# Altium schematic sheet STM32F407VET6.SchDoc
size 566 x 304 mm
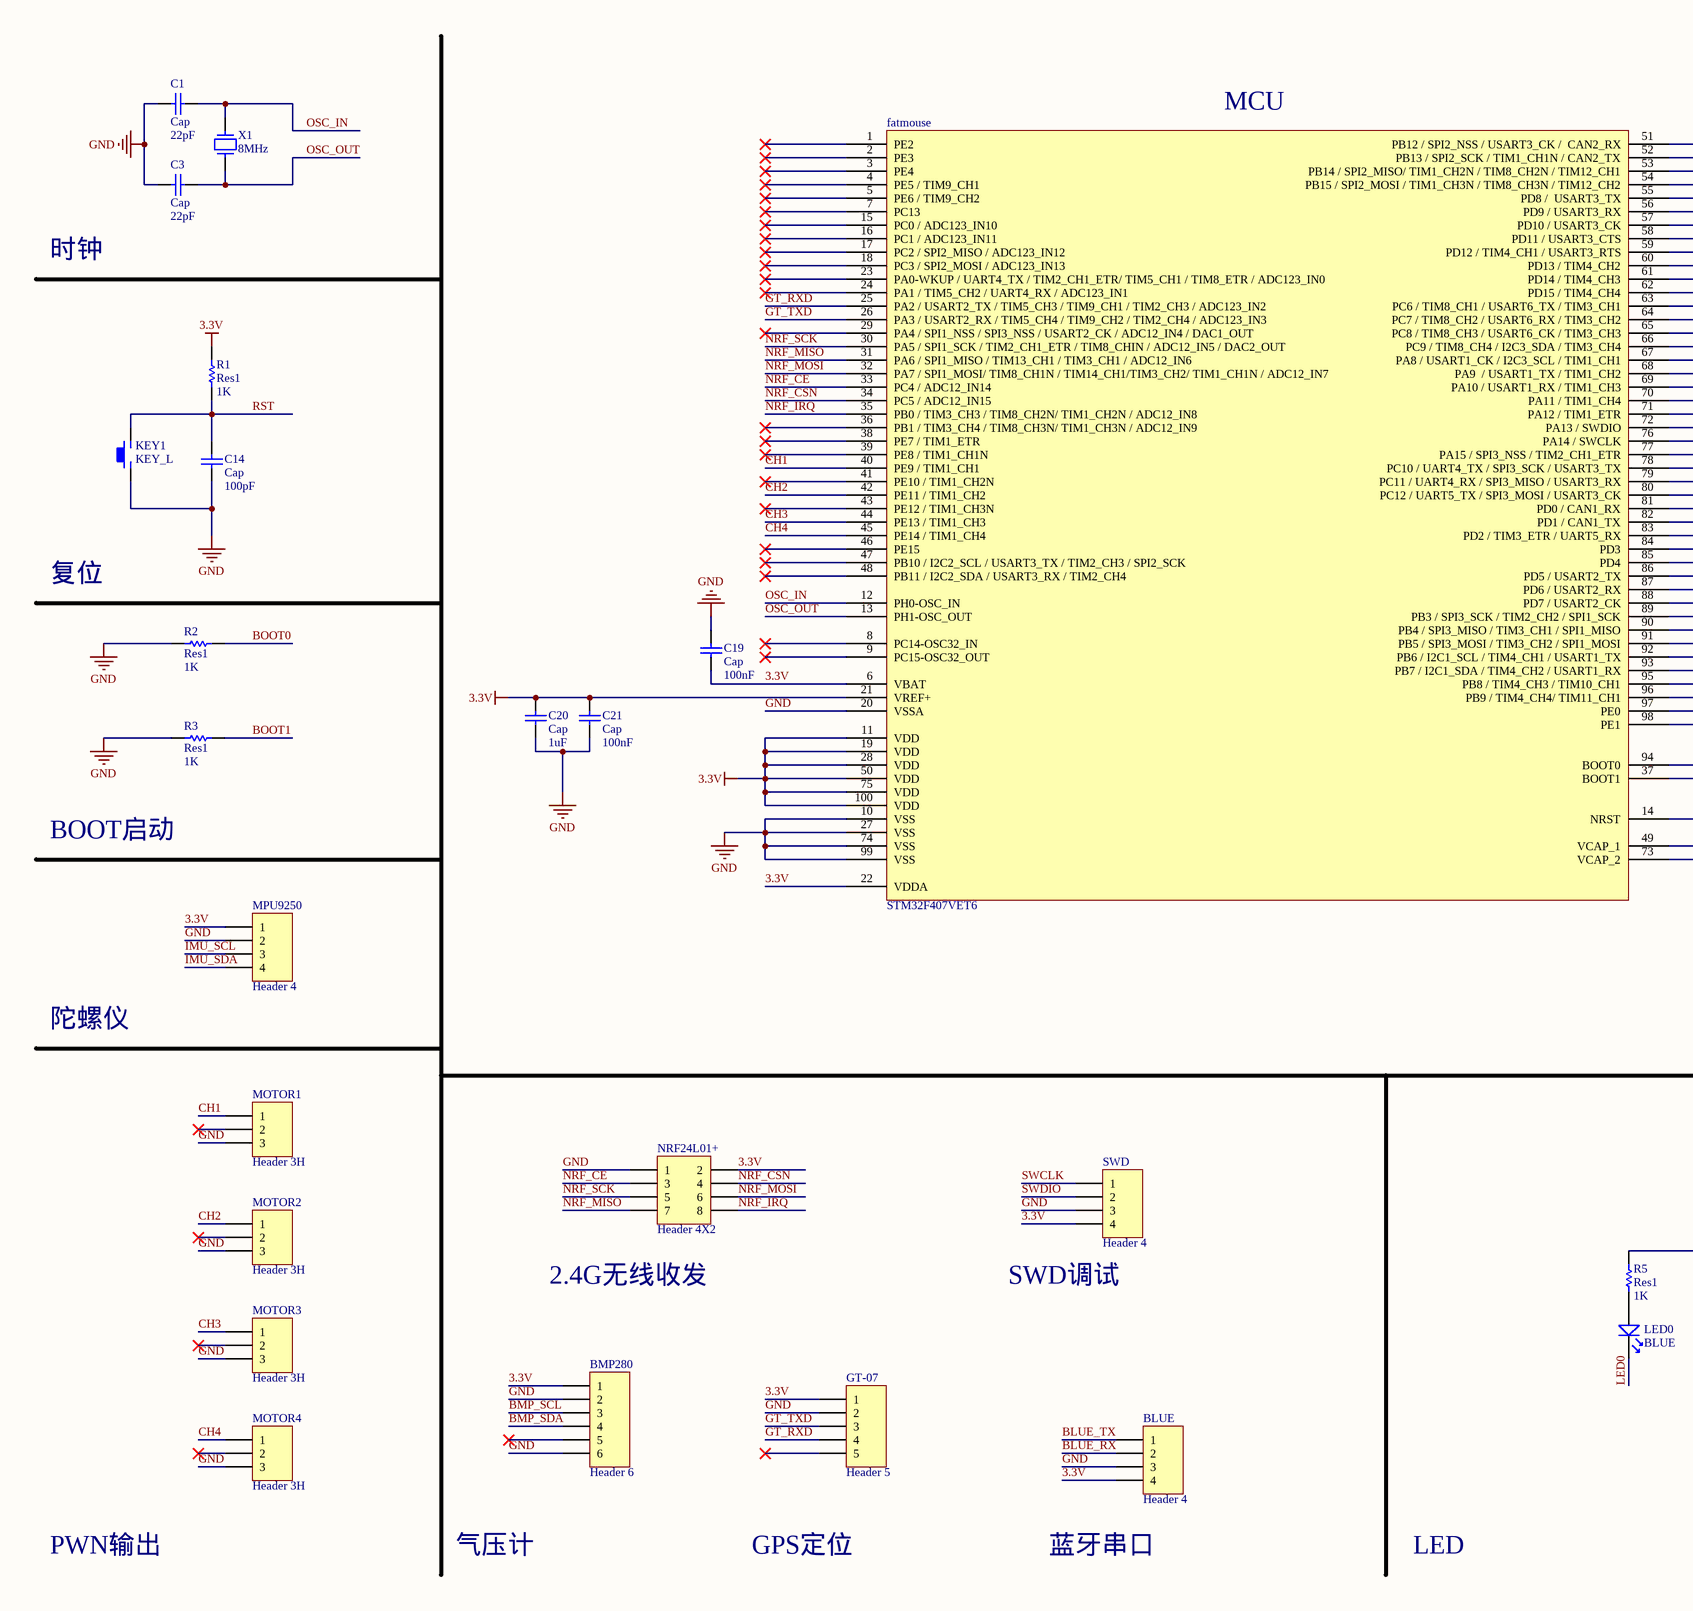
[diagram p0: STM32F407VET6.SchDoc, left]
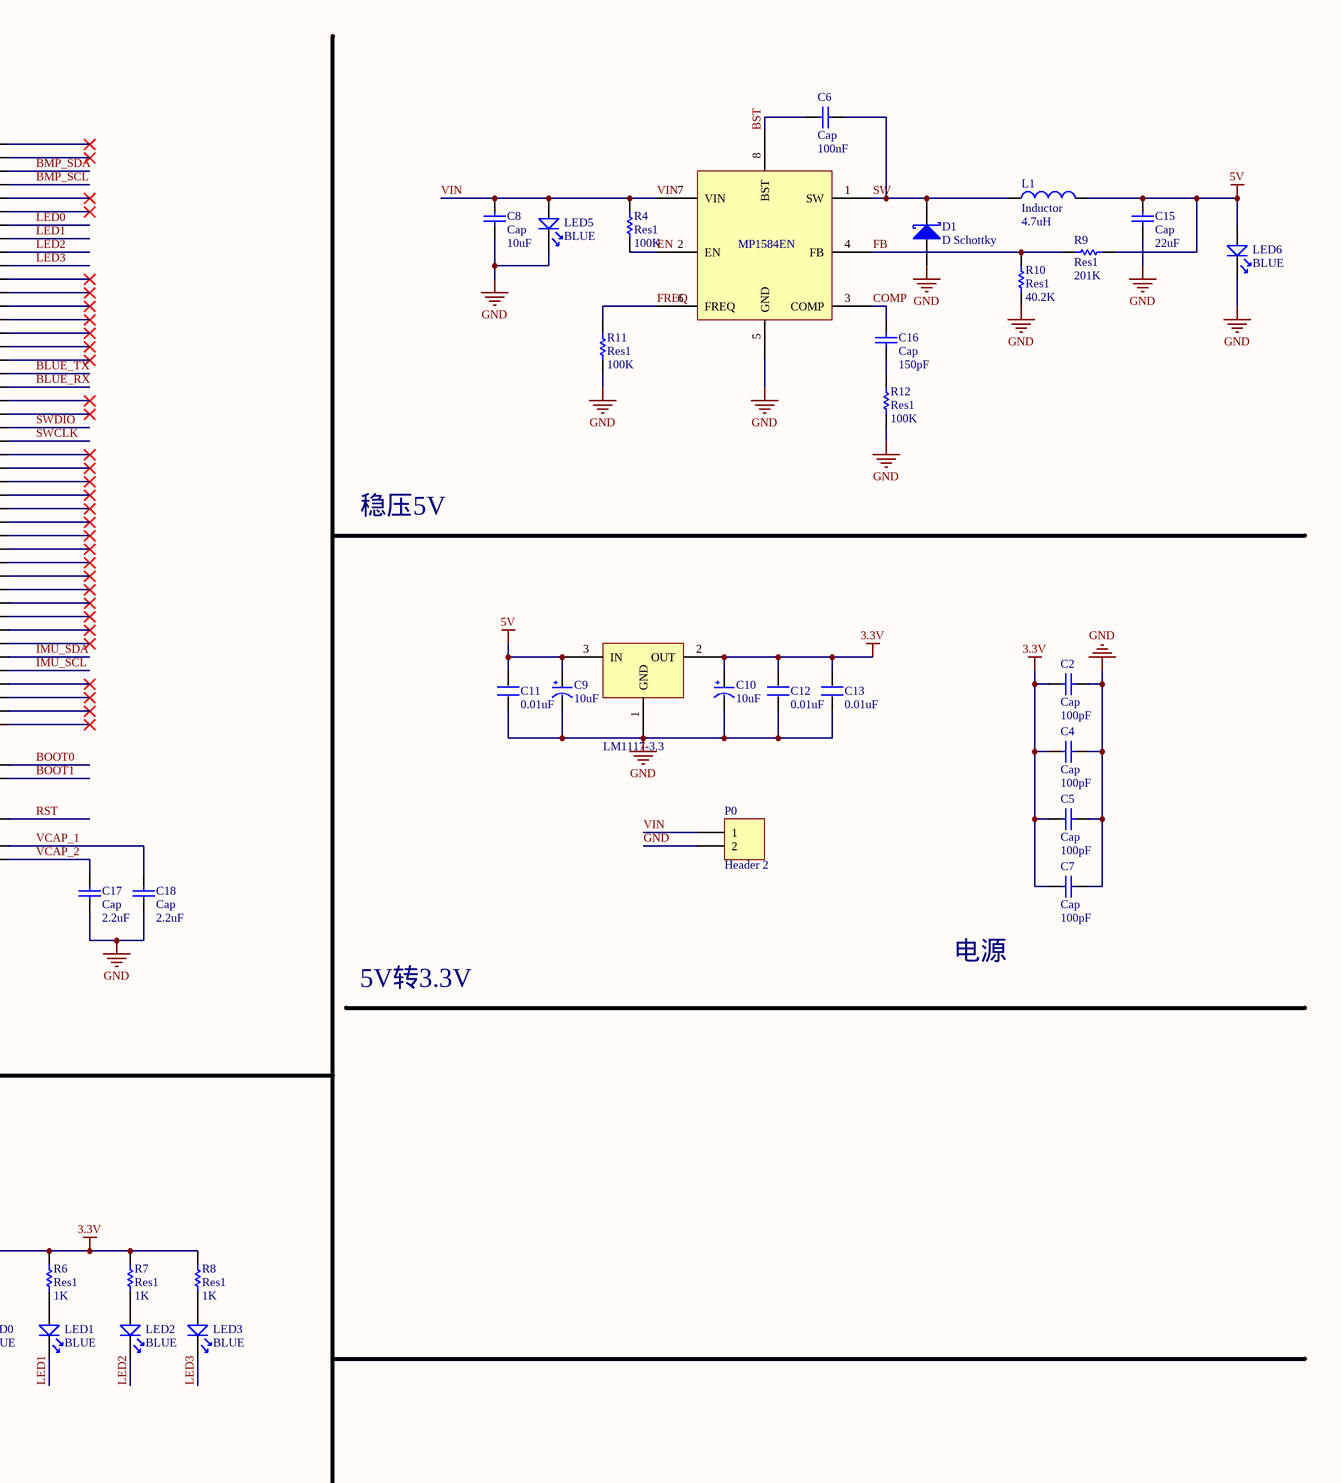
[diagram p1: STM32F407VET6.SchDoc, right]

## Parts
5V-3.3V  LM1117-3.3  [SOT223_M]
BLUE  Header 4  [PIN-4-2.54-1.0]
BMP280  Header 6  [HDR1X6]
C1  Cap  value 22pF  [C 0805]
C2  Cap  value 100pF  [C 0805]
C3  Cap  value 22pF  [C 0805]
C4  Cap  value 100pF  [C 0805]
C5  Cap  value 100pF  [C 0805]
C6  Cap  value 100nF  [C 0805]
C7  Cap  value 100pF  [C 0805]
C8  Cap  value 10uF  [C 0805]
C9  10uF  [CD A(3216)]
C10  10uF  [CD A(3216)]
C11  0.01uF  [C 0805]
C12  0.01uF  [C 0805]
C13  0.01uF  [C 0805]
C14  Cap  value 100pF  [C 0805]
C15  Cap  value 22uF  [C 0805]
C16  Cap  value 150pF  [C 0805]
C17  Cap  value 2.2uF  [C 0805]
C18  Cap  value 2.2uF  [C 0805]
C19  Cap  value 100nF  [C 0805]
C20  Cap  value 1uF  [C 0805]
C21  Cap  value 100nF  [C 0805]
D1  D Schottky  [SMA]
fatmouse  STM32F407VET6  [QFP-100-0.5]
GT-07  Header 5  [HDR1X5]
KEY1  KEY_L  [key]
L1  Inductor  value 4.7uH  [CDRH74]
LED0  BLUE  [LED-0805]
LED1  BLUE  [LED-0805]
LED2  BLUE  [LED-0805]
LED3  BLUE  [LED-0805]
LED5  BLUE  [LED-0805]
LED6  BLUE  [LED-0805]
MOTOR1  Header 3H  [HDR1X3H]
MOTOR2  Header 3H  [HDR1X3H]
MOTOR3  Header 3H  [HDR1X3H]
MOTOR4  Header 3H  [HDR1X3H]
MP1584EN  MP1584EN  [LC-SOIC-8_EP_150mil]
MPU9250  Header 4  [HDR1X4]
NRF24L01+  Header 4X2  [HDR2X4]
P0  Header 2  [xt30]
R1  Res1  value 1K  [0805]
R2  Res1  value 1K  [0805]
R3  Res1  value 1K  [0805]
R4  Res1  value 100K  [0805]
R5  Res1  value 1K  [0805]
R6  Res1  value 1K  [0805]
R7  Res1  value 1K  [0805]
R8  Res1  value 1K  [0805]
R9  Res1  value 201K  [0805]
R10  Res1  value 40.2K  [0805]
R11  Res1  value 100K  [0805]
R12  Res1  value 100K  [0805]
SWD  Header 4  [PIN-4-2.54-1.0]
X1  8MHz  [HC49S]

## Nets
3.3V: 5V-3.3V.2(OUT) BLUE.4 BMP280.1 C2.1 C4.1 C5.1 C7.1 C10.1(VCC) C12.2 C13.2 C19.1 C20.2 C21.2 fatmouse.6(VBAT) fatmouse.11(VDD) fatmouse.19(VDD) fatmouse.21(VREF+) fatmouse.22(VDDA) fatmouse.28(VDD) fatmouse.50(VDD) fatmouse.75(VDD) fatmouse.100(VDD) GT-07.1 MPU9250.1 NRF24L01+.2 R1.2 R5.2 R6.2 R7.2 R8.2 SWD.4
5V: 5V-3.3V.3(IN) C9.1(VCC) C11.2 C15.1 L1.2 LED6.1 R9.1
GND: 5V-3.3V.1(GND) BLUE.3 BMP280.2 BMP280.6 C1.1 C2.2 C3.1 C4.2 C5.2 C7.2 C8.2 C9.2(GND) C10.2(GND) C11.1 C12.1 C13.1 C14.1 C15.2 C17.2 C18.2 C19.2 C20.1 C21.1 D1.1(A) fatmouse.10(VSS) fatmouse.20(VSSA) fatmouse.27(VSS) fatmouse.74(VSS) fatmouse.99(VSS) GT-07.2 KEY1.1 LED5.2 LED6.2 MOTOR1.3 MOTOR2.3 MOTOR3.3 MOTOR4.3 MP1584EN.5(GND) MPU9250.2 NRF24L01+.1 P0.2 R2.1 R3.1 R10.1 R11.1 R12.1 SWD.3
BLUE_RX: BLUE.2 fatmouse.69(PA10_/_USART1_RX_/_TIM1_CH3)
BLUE_TX: BLUE.1 fatmouse.68(PA9__/_USART1_TX_/_TIM1_CH2)
BMP_SCL: BMP280.3 fatmouse.54(PB15_/_SPI2_MOSI_/_TIM1_CH3N_/_TIM8_CH3N_/_TIM12_CH2)
BMP_SDA: BMP280.4 fatmouse.53(PB14_/_SPI2_MISO/_TIM1_CH2N_/_TIM8_CH2N_/_TIM12_CH1)
BOOT0: fatmouse.94(BOOT0) R2.2
BOOT1: fatmouse.37(BOOT1) R3.2
BST: C6.1 MP1584EN.8(BST)
CH1: fatmouse.40(PE9_/_TIM1_CH1) MOTOR1.1
CH2: fatmouse.42(PE11_/_TIM1_CH2) MOTOR2.1
CH3: fatmouse.44(PE13_/_TIM1_CH3) MOTOR3.1
CH4: fatmouse.45(PE14_/_TIM1_CH4) MOTOR4.1
COMP: C16.2 MP1584EN.3(COMP)
EN: MP1584EN.2(EN) R4.1
FB: MP1584EN.4(FB) R9.2 R10.2
FREQ: MP1584EN.6(FREQ) R11.2
GT_RXD: fatmouse.25(PA2_/_USART2_TX_/_TIM5_CH3_/_TIM9_CH1_/_TIM2_CH3_/_ADC123_IN2) GT-07.4
GT_TXD: fatmouse.26(PA3_/_USART2_RX_/_TIM5_CH4_/_TIM9_CH2_/_TIM2_CH4_/_ADC123_IN3) GT-07.3
IMU_SCL: fatmouse.93(PB7_/_I2C1_SDA_/_TIM4_CH2_/_USART1_RX) MPU9250.3
IMU_SDA: fatmouse.92(PB6_/_I2C1_SCL_/_TIM4_CH1_/_USART1_TX) MPU9250.4
LED0: fatmouse.57(PD10_/_USART3_CK) LED0.2
LED1: fatmouse.58(PD11_/_USART3_CTS) LED1.2
LED2: fatmouse.59(PD12_/_TIM4_CH1_/_USART3_RTS) LED2.2
LED3: fatmouse.60(PD13_/_TIM4_CH2) LED3.2
NRF_CE: fatmouse.33(PC4_/_ADC12_IN14) NRF24L01+.3
NRF_CSN: fatmouse.34(PC5_/_ADC12_IN15) NRF24L01+.4
NRF_IRQ: fatmouse.35(PB0_/_TIM3_CH3_/_TIM8_CH2N/_TIM1_CH2N_/_ADC12_IN8) NRF24L01+.8
NRF_MISO: fatmouse.31(PA6_/_SPI1_MISO_/_TIM13_CH1_/_TIM3_CH1_/_ADC12_IN6) NRF24L01+.7
NRF_MOSI: fatmouse.32(PA7_/_SPI1_MOSI/_TIM8_CH1N_/_TIM14_CH1/TIM3_CH2/_TIM1_CH1N_/_ADC12_IN7) NRF24L01+.6
NRF_SCK: fatmouse.30(PA5_/_SPI1_SCK_/_TIM2_CH1_ETR_/_TIM8_CHIN_/_ADC12_IN5_/_DAC2_OUT) NRF24L01+.5
OSC_IN: C1.2 fatmouse.12(PH0-OSC_IN) X1.1
OSC_OUT: C3.2 fatmouse.13(PH1-OSC_OUT) X1.2
RST: C14.2 fatmouse.14(NRST) KEY1.2 R1.1
SW: C6.2 D1.2(K) L1.1 MP1584EN.1(SW)
SWCLK: fatmouse.76(PA14_/_SWCLK) SWD.1
SWDIO: fatmouse.72(PA13_/_SWDIO) SWD.2
VCAP_1: C18.1 fatmouse.49(VCAP_1)
VCAP_2: C17.1 fatmouse.73(VCAP_2)
VIN: C8.1 LED5.1 MP1584EN.7(VIN) P0.1 R4.2
NetC16_1: C16.1 R12.2
NetLED0_1: LED0.1 R5.1
NetLED1_1: LED1.1 R6.1
NetLED2_1: LED2.1 R7.1
NetLED3_1: LED3.1 R8.1

Not connected (* = marked no-connect by the designer): BMP280 5*; fatmouse 1(PE2)* 2(PE3)* 3(PE4)* 4(PE5_/_TIM9_CH1)* 5(PE6_/_TIM9_CH2)* 7(PC13)* 8(PC14-OSC32_IN)* 9(PC15-OSC32_OUT)* 15(PC0_/_ADC123_IN10)* 16(PC1_/_ADC123_IN11)* 17(PC2_/_SPI2_MISO_/_ADC123_IN12)* 18(PC3_/_SPI2_MOSI_/_ADC123_IN13)* 23(PA0-WKUP_/_UART4_TX_/_TIM2_CH1_ETR/_TIM5_CH1_/_TIM8_ETR_/_ADC123_IN0)* 24(PA1_/_TIM5_CH2_/_UART4_RX_/_ADC123_IN1)* 29(PA4_/_SPI1_NSS_/_SPI3_NSS_/_USART2_CK_/_ADC12_IN4_/_DAC1_OUT)* 36(PB1_/_TIM3_CH4_/_TIM8_CH3N/_TIM1_CH3N_/_ADC12_IN9)* 38(PE7_/_TIM1_ETR)* 39(PE8_/_TIM1_CH1N)* 41(PE10_/_TIM1_CH2N)* 43(PE12_/_TIM1_CH3N)* 46(PE15)* 47(PB10_/_I2C2_SCL_/_USART3_TX_/_TIM2_CH3_/_SPI2_SCK)* 48(PB11_/_I2C2_SDA_/_USART3_RX_/_TIM2_CH4)* 51(PB12_/_SPI2_NSS_/_USART3_CK_/__CAN2_RX)* 52(PB13_/_SPI2_SCK_/_TIM1_CH1N_/_CAN2_TX)* 55(PD8_/__USART3_TX)* 56(PD9_/_USART3_RX)* 61(PD14_/_TIM4_CH3)* 62(PD15_/_TIM4_CH4)* 63(PC6_/_TIM8_CH1_/_USART6_TX_/_TIM3_CH1)* 64(PC7_/_TIM8_CH2_/_USART6_RX_/_TIM3_CH2)* 65(PC8_/_TIM8_CH3_/_USART6_CK_/_TIM3_CH3)* 66(PC9_/_TIM8_CH4_/_I2C3_SDA_/_TIM3_CH4)* 67(PA8_/_USART1_CK_/_I2C3_SCL_/_TIM1_CH1)* 70(PA11_/_TIM1_CH4)* 71(PA12_/_TIM1_ETR)* 77(PA15_/_SPI3_NSS_/_TIM2_CH1_ETR)* 78(PC10_/_UART4_TX_/_SPI3_SCK_/_USART3_TX)* 79(PC11_/_UART4_RX_/_SPI3_MISO_/_USART3_RX)* 80(PC12_/_UART5_TX_/_SPI3_MOSI_/_USART3_CK)* 81(PD0_/_CAN1_RX)* 82(PD1_/_CAN1_TX)* 83(PD2_/_TIM3_ETR_/_UART5_RX)* 84(PD3)* 85(PD4)* 86(PD5_/_USART2_TX)* 87(PD6_/_USART2_RX)* 88(PD7_/_USART2_CK)* 89(PB3_/_SPI3_SCK_/_TIM2_CH2_/_SPI1_SCK)* 90(PB4_/_SPI3_MISO_/_TIM3_CH1_/_SPI1_MISO)* 91(PB5_/_SPI3_MOSI_/_TIM3_CH2_/_SPI1_MOSI)* 95(PB8_/_TIM4_CH3_/_TIM10_CH1)* 96(PB9_/_TIM4_CH4/_TIM11_CH1)* 97(PE0)* 98(PE1)*; GT-07 5*; MOTOR1 2*; MOTOR2 2*; MOTOR3 2*; MOTOR4 2*

## Notes on the sheet
- (near fatmouse) MCU
- 时钟
- 稳压5V
- 复位
- BOOT启动
- 电源
- 陀螺仪
- 5V转3.3V
- (near NRF24L01+) 2.4G无线收发
- (near SWD) SWD调试
- PWN输出
- 气压计
- GPS定位
- 蓝牙串口
- LED

## Library data of the parts
BLUE MPU9250 SWD = Header 4: Header, 4-Pin; LatestRevisionDate: 17-Jul-2002; LatestRevisionNote: Re-released for DXP Platform.; Publisher: Altium Limited
BMP280 = Header 6: Header, 6-Pin; LatestRevisionDate: 17-Jul-2002; LatestRevisionNote: Re-released for DXP Platform.; Publisher: Altium Limited
C1-C8 C14-C21 = Cap: Capacitor; Published: 8-Jun-2000; LatestRevisionDate: 17-Jul-2002; LatestRevisionNote: Re-released for DXP Platform.; PackageReference: RAD-0.3; Publisher: Altium Limited; PackageDescription: Radial Cap, Thru-Hole; 2 Leads; 0.3 in Pin Spacing
C9 C10 = CAP
C11-C13 = C
D1 = D Schottky: Schottky Diode; Published: 8-Jun-2000; LatestRevisionDate: 17-Jul-2002; LatestRevisionNote: Re-released for DXP Platform.; PackageReference: SMB; Publisher: Altium Limited; PackageDescription: DO-214-AA/SMB; 2 C-Bend Leads; Body 5.3 x 3.6 mm, inc. leads (LxW); Code_JEDEC: DO-214-AA
GT-07 = Header 5: Header, 5-Pin; LatestRevisionDate: 17-Jul-2002; LatestRevisionNote: Re-released for DXP Platform.; Publisher: Altium Limited
KEY1 = KEY
L1 = Inductor: Code_IEC: 1005; Published: 8-Jun-2000; LatestRevisionDate: 29-May-2009; LatestRevisionNote: IPC-7351 Footprint Added.; PackageReference: 0402-A; Publisher: Altium Limited; PackageDescription: Chip Inductor; Code_JEITA: 0402
LED0-LED3 LED5 LED6 = LED
MOTOR1-MOTOR4 = Header 3H: Header, 3-Pin, Right Angle; LatestRevisionDate: 17-Jul-2002; LatestRevisionNote: Re-released for DXP Platform.; Publisher: Altium Limited
NRF24L01+ = Header 4X2: Header, 4-Pin, Dual row; LatestRevisionDate: 17-Jul-2002; LatestRevisionNote: Re-released for DXP Platform.; Publisher: Altium Limited
P0 = Header 2: Header, 2-Pin; LatestRevisionDate: 17-Jul-2002; LatestRevisionNote: Re-released for DXP Platform.; Publisher: Altium Limited
R1-R12 = Res1: Resistor; Published: 8-Jun-2000; LatestRevisionDate: 17-Jul-2002; LatestRevisionNote: Re-released for DXP Platform.; PackageReference: AXIAL-0.3; Publisher: Altium Limited; PackageDescription: Axial Device, Thru-Hole; 2 Leads; 0.3 in Pin Spacing
X1 = XTAL-2: Crystal